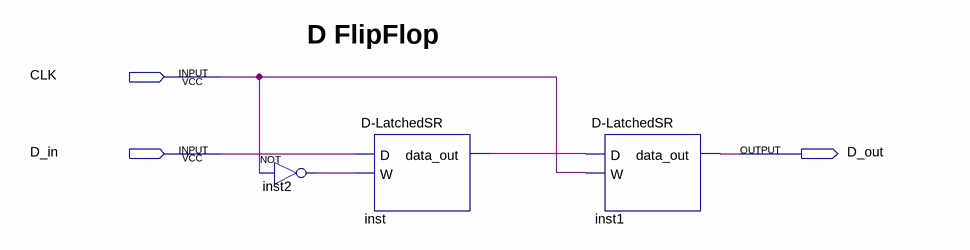
[diagram p0: schematic sheet]
// Quartus schematic D_FlipFlop.bdf as structural Verilog: 3 symbols, 3 pins
module D_FlipFlop (
  input  CLK,
  input  D_in,
  output D_out
);

  wire inst2_out, inst_data_out;

  not inst2 (inst2_out, CLK);
  \D-LatchedSR  inst (.D(D_in), .W(inst2_out), .data_out(inst_data_out));
  \D-LatchedSR  inst1 (.D(inst_data_out), .W(CLK), .data_out(D_out));

  // Notes on the sheet:
  //   D FlipFlop
endmodule
